# Altium schematic sheet NCS_wireless_display_595.SchDoc
size A
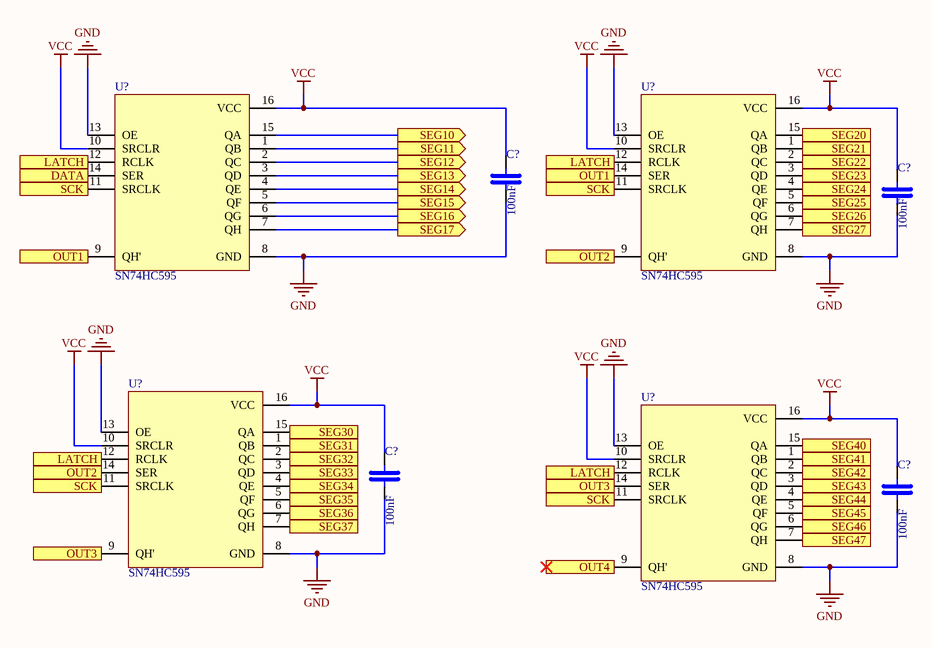
[diagram p0: NCS_wireless_display_595.SchDoc]

## Parts
(Parts that share a designator on the sheet are numbered #1, #2 ... from top to bottom, then left to right.)
C?#1  100nF  [C0805C104K3RACTU_100nF]
C?#2  100nF  [C0805C104K3RACTU_100nF]
C?#3  100nF  [C0805C104K3RACTU_100nF]
C?#4  100nF  [C0805C104K3RACTU_100nF]
U?#1  SN74HC595  [SN74HC595_SOIC16]
U?#2  SN74HC595  [SN74HC595_SOIC16]
U?#3  SN74HC595  [SN74HC595_SOIC16]
U?#4  SN74HC595  [SN74HC595_SOIC16]

## Ports
DATA (out), LATCH (out), OUT1 (out), OUT2 (out), OUT3 (out), OUT4 (out), SCK (out), SEG10 (out), SEG11 (out), SEG12 (out), SEG13 (out), SEG14 (out), SEG15 (out), SEG16 (out), SEG17 (out), SEG20 (out), SEG21 (out), SEG22 (out), SEG23 (out), SEG24 (out), SEG25 (out), SEG26 (out), SEG27 (out), SEG30 (out), SEG31 (out), SEG32 (out), SEG33 (out), SEG34 (out), SEG35 (out), SEG36 (out), SEG37 (out), SEG40 (out), SEG41 (out), SEG42 (out), SEG43 (out), SEG44 (out), SEG45 (out), SEG46 (out), SEG47 (out)

## Nets
GND: C?#1.1 C?#2.1 C?#3.1 C?#4.1 U?#1.8(GND) U?#1.13(OE) U?#2.8(GND) U?#2.13(OE) U?#3.8(GND) U?#3.13(OE) U?#4.8(GND) U?#4.13(OE)
VCC: C?#1.2 C?#2.2 C?#3.2 C?#4.2 U?#1.10(SRCLR) U?#1.16(VCC) U?#2.10(SRCLR) U?#2.16(VCC) U?#3.10(SRCLR) U?#3.16(VCC) U?#4.10(SRCLR) U?#4.16(VCC)
DATA: U?#1.14(SER) ; port DATA
LATCH: U?#1.12(RCLK) U?#2.12(RCLK) U?#3.12(RCLK) U?#4.12(RCLK) ; port LATCH
OUT1: U?#1.9(QH') U?#2.14(SER) ; port OUT1
OUT2: U?#2.9(QH') U?#3.14(SER) ; port OUT2
OUT3: U?#3.9(QH') U?#4.14(SER) ; port OUT3
OUT4: U?#4.9(QH') ; port OUT4
SCK: U?#1.11(SRCLK) U?#2.11(SRCLK) U?#3.11(SRCLK) U?#4.11(SRCLK) ; port SCK
SEG10: U?#1.15(QA) ; port SEG10
SEG11: U?#1.1(QB) ; port SEG11
SEG12: U?#1.2(QC) ; port SEG12
SEG13: U?#1.3(QD) ; port SEG13
SEG14: U?#1.4(QE) ; port SEG14
SEG15: U?#1.5(QF) ; port SEG15
SEG16: U?#1.6(QG) ; port SEG16
SEG17: U?#1.7(QH) ; port SEG17
SEG20: U?#2.15(QA) ; port SEG20
SEG21: U?#2.1(QB) ; port SEG21
SEG22: U?#2.2(QC) ; port SEG22
SEG23: U?#2.3(QD) ; port SEG23
SEG24: U?#2.4(QE) ; port SEG24
SEG25: U?#2.5(QF) ; port SEG25
SEG26: U?#2.6(QG) ; port SEG26
SEG27: U?#2.7(QH) ; port SEG27
SEG30: U?#3.15(QA) ; port SEG30
SEG31: U?#3.1(QB) ; port SEG31
SEG32: U?#3.2(QC) ; port SEG32
SEG33: U?#3.3(QD) ; port SEG33
SEG34: U?#3.4(QE) ; port SEG34
SEG35: U?#3.5(QF) ; port SEG35
SEG36: U?#3.6(QG) ; port SEG36
SEG37: U?#3.7(QH) ; port SEG37
SEG40: U?#4.15(QA) ; port SEG40
SEG41: U?#4.1(QB) ; port SEG41
SEG42: U?#4.2(QC) ; port SEG42
SEG43: U?#4.3(QD) ; port SEG43
SEG44: U?#4.4(QE) ; port SEG44
SEG45: U?#4.5(QF) ; port SEG45
SEG46: U?#4.6(QG) ; port SEG46
SEG47: U?#4.7(QH) ; port SEG47

## Library data of the parts
C?#1-C?#4 = C0805C104K3RACTU: Multilayer Ceramic Capacitor, 0.1 uF, 25 V, ï¿½ 10%, X7R, 0805 [2012 Metric]; Manufacturer: KEMET; Material: 4241ConductorMaterial; Voltage Rating: 25V; Temperature Coefficient: 30ppm/°C; Supplier: Mouser; Supplier Part Number: 80-C0805C104K3R; Manufacturer Part Number: C0805C104K3RACTU; RoHS: Yes; Category: Ceramic Capacitors; Stock: 259681; Pricing: 1=0.1, 10=0.03, 50=0.03, 100=0.027, 1000=0.021, 10000=0.015 (USD); Mounting Technology: Surface Mount,PCB; Case/Package: 0805; Pins: 2NUMBER; Case Code (Imperial): 0805; Case Code (Metric): 2012; Min Operating Temperature: -55°C; Max Operating Temperature: 125°C; Packaging: Tape and Reel; Tolerance: 10%; Value: 100nF; Dielectric: X7R; Termination: SMD/SMT; Package Quantity: 4000; Series: SMD Comm X7R; Voltage Rating (DC): 25V; Construction: Flat; Length: 2mm; Width: 1.2mm; Height: 0.9mm; Depth: 1.25mm; Lead Pitch: 0.75mm; Thickness: 889um; Radiation Hardening: No; RoHS Compliant: Yes; Lead Free: 5697LeadFree; Reach SVHC Compliant: 4186SVHC; ComponentLink1URL: https://datasheet.ciiva.com/7842/kem-c1002-x7r-smd-7842536.pdf?src-supplier=Element14; ComponentLink1Description: https://datasheet.ciiva.com/7842/kem-c1002-x7r-smd-7842536.pdf?src-supplier=Element14; ComponentLink2URL: https://datasheet.ciiva.com/7842/kem-c1002-x7r-smd-7842538.pdf?src-supplier=Element14; ComponentLink2Description: https://datasheet.ciiva.com/7842/kem-c1002-x7r-smd-7842538.pdf?src-supplier=Element14
U?#1-U?#4 = SN74HC595DR: HC/UH 74HC595 ROHS3Compliant Cut Tape (CT) shift register 34ns 1muA 141.690917mg 42MHz; Manufacturer: Texas Instruments; Supplier 1: Mouser; Manufacturer Part Number: SN74HC595DR; RoHS: Yes; Category: Shift Registers; Stock 1: 113533; Pricing 1: 1=0.26, 10=0.16, 50=0.16, 100=0.12, 1000=0.115, 10000=0.1 (USD); ComponentLink1URL: https://datasheet.ciiva.com/34301/916385-34301758.pdf?src-supplier=Jameco; ComponentLink1Description: https://datasheet.ciiva.com/34301/916385-34301758.pdf?src-supplier=Jameco; ComponentLink2URL: https://datasheet.ciiva.com/15093/getdatasheetpartid-134875-15093436.pdf?src-supplier=Verical; ComponentLink2Description: https://datasheet.ciiva.com/15093/getdatasheetpartid-134875-15093436.pdf?src-supplier=Verical; ComponentLink3URL: https://datasheet.ciiva.com/22696/1831198-22696812.pdf?src-supplier=Element14; ComponentLink3Description: https://datasheet.ciiva.com/22696/1831198-22696812.pdf?src-supplier=Element14; ComponentLink4URL: https://datasheet.ciiva.com/1886/sn74hc595-1886279.pdf?src-supplier=Digikey; ComponentLink4Description: https://datasheet.ciiva.com/1886/sn74hc595-1886279.pdf?src-supplier=Digikey; ComponentLink5URL: https://datasheet.ciiva.com/1886/sn74hc595-1886280.pdf?src-supplier=Digikey; ComponentLink5Description: https://datasheet.ciiva.com/1886/sn74hc595-1886280.pdf?src-supplier=Digikey; ComponentLink6URL: https://datasheet.ciiva.com/1886/sn74hc595-1886281.pdf?src-supplier=Digikey; ComponentLink6Description: https://datasheet.ciiva.com/1886/sn74hc595-1886281.pdf?src-supplier=Digikey; ComponentLink7URL: https://datasheet.ciiva.com/14294/sn74hc595-14294989.pdf?src-supplier=Avnet; ComponentLink7Description: https://datasheet.ciiva.com/14294/sn74hc595-14294989.pdf?src-supplier=Avnet; ComponentLink8URL: https://datasheet.ciiva.com/14294/sn74hc595-14294991.pdf?src-supplier=Avnet; ComponentLink8Description: https://datasheet.ciiva.com/14294/sn74hc595-14294991.pdf?src-supplier=Avnet; ComponentLink9URL: https://datasheet.ciiva.com/46435/1831198-46435871.pdf?src-supplier=Element14; ComponentLink9Description: https://datasheet.ciiva.com/46435/1831198-46435871.pdf?src-supplier=Element14; ComponentLink10URL: https://datasheet.ciiva.com/46381/1886142-46381835.pdf?src-supplier=Element14; ComponentLink10Description: https://datasheet.ciiva.com/46381/1886142-46381835.pdf?src-supplier=Element14; ComponentLink11URL: https://datasheet.ciiva.com/1509/1831198-1509483.pdf?src-supplier=Element14; ComponentLink11Description: https://datasheet.ciiva.com/1509/1831198-1509483.pdf?src-supplier=Element14; Supplier Part Number 1: 595-SN74HC595DR